# Altium schematic sheet 3723_connectors.SchDoc
size A3; SheetNumber: 2; SheetTotal: 3
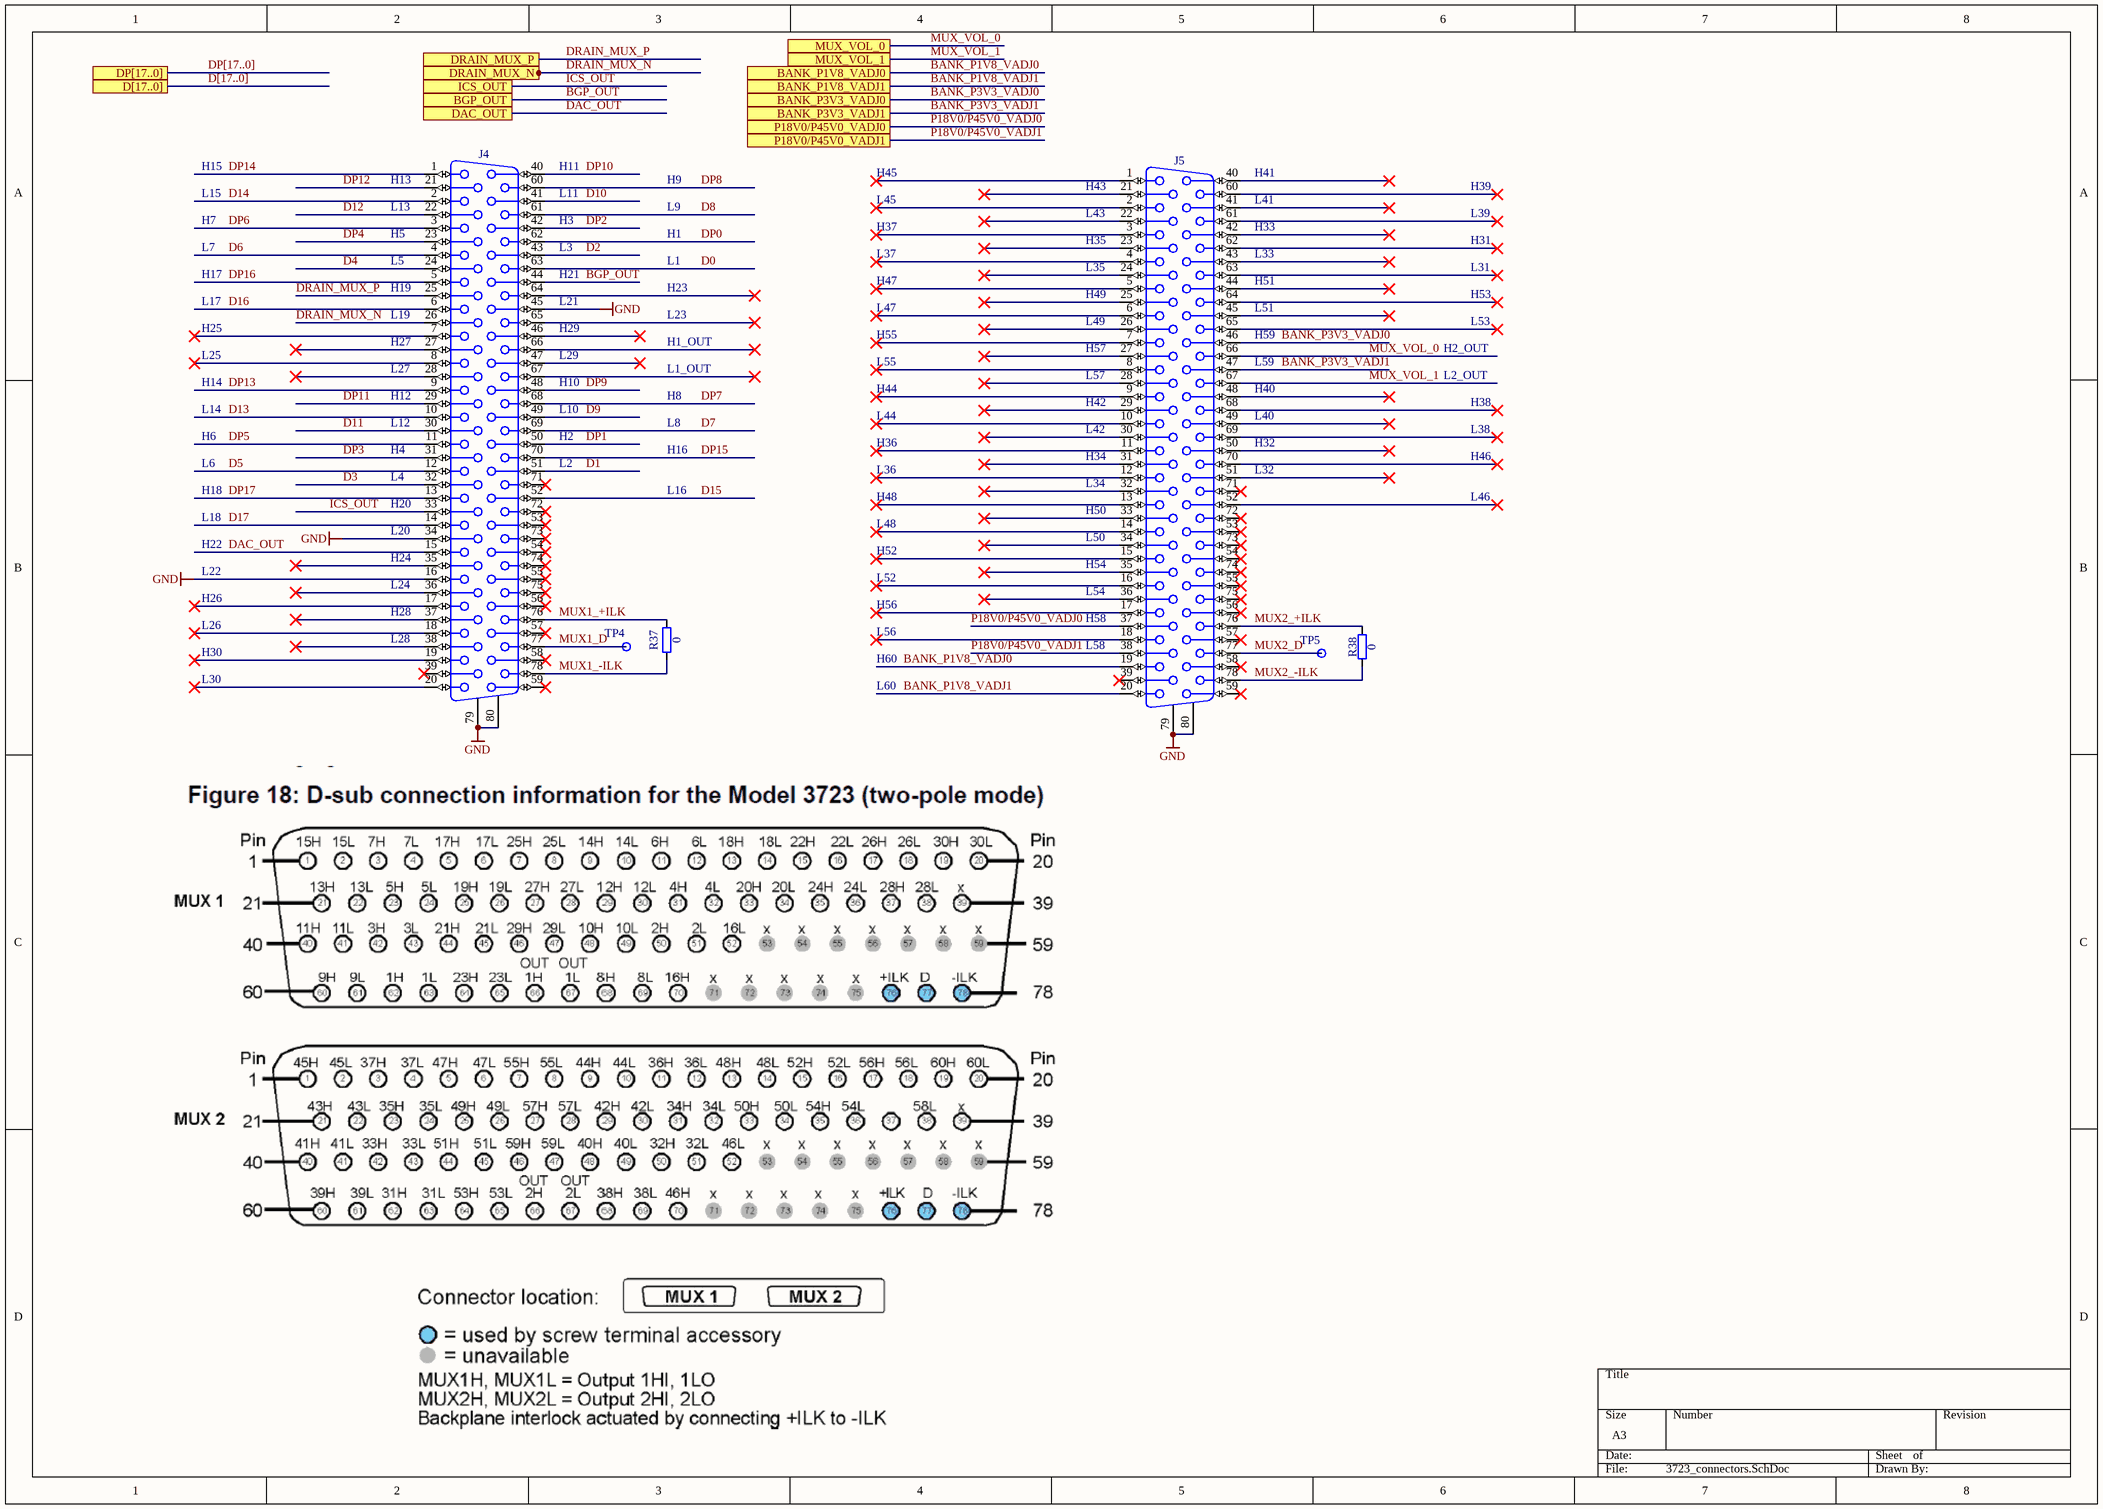
[diagram p0: 3723_connectors.SchDoc]

## Parts
J4  D-Sub 78F  [HARTING_09 56 551 7513]  (value not drawn)
J5  D-Sub 78F  [HARTING_09 56 551 7513]  (value not drawn)
R37  0  [RESC1005X40N]
R38  0  [RESC1005X40N]
TP4  Test Point  [TPS127]  (value not drawn)
TP5  Test Point  [TPS127]  (value not drawn)

## Ports
BANK_P1V8_VADJ0 (see top_PW[5A], 3732_connectors[1C]), BANK_P1V8_VADJ1 (see top_PW[5A], 3732_connectors[1C]), BANK_P3V3_VADJ0 (see top_PW[5A], 3732_connectors[3C]), BANK_P3V3_VADJ1 (see top_PW[5A], 3732_connectors[3C]), BGP_OUT (see top_PW[4A]), D[17..0] (see top_PW[4A]), DAC_OUT (see top_PW[4A]), DP[17..0] (see top_PW[4A]), DRAIN_MUX_N (see top_PW[4A]), DRAIN_MUX_P (see top_PW[4A]), ICS_OUT (see top_PW[4A]), MUX_VOL_0, MUX_VOL_1 (see top_PW[5A]), P18V0/P45V0_VADJ0 (see top_PW[5A]), P18V0/P45V0_VADJ1 (see top_PW[5A])

## Nets
GND: J4.16 J4.34 J4.45 J4.79 J4.80 J5.79 J5.80
BANK_P1V8_VADJ0: J5.19 ; port BANK_P1V8_VADJ0
BANK_P1V8_VADJ1: J5.20 ; port BANK_P1V8_VADJ1
BANK_P3V3_VADJ0: J5.46 ; port BANK_P3V3_VADJ0
BANK_P3V3_VADJ1: J5.47 ; port BANK_P3V3_VADJ1
BGP_OUT: J4.44 ; port BGP_OUT
D0: J4.63
D1: J4.51
D2: J4.43
D3: J4.32
D4: J4.24
D5: J4.12
D6: J4.4
D7: J4.69
D8: J4.61
D9: J4.49
D10: J4.41
D11: J4.30
D12: J4.22
D13: J4.10
D14: J4.2
D15: J4.52
D16: J4.6
D17: J4.14
DAC_OUT: J4.15 ; port DAC_OUT
DP0: J4.62
DP1: J4.50
DP2: J4.42
DP3: J4.31
DP4: J4.23
DP5: J4.11
DP6: J4.3
DP7: J4.68
DP8: J4.60
DP9: J4.48
DP10: J4.40
DP11: J4.29
DP12: J4.21
DP13: J4.9
DP14: J4.1
DP15: J4.70
DP16: J4.5
DP17: J4.13
DRAIN_MUX_N: J4.26 ; port DRAIN_MUX_N
DRAIN_MUX_P: J4.25 ; port DRAIN_MUX_P
ICS_OUT: J4.33 ; port ICS_OUT
MUX1_+ILK: J4.76 R37.2
MUX1_-ILK: J4.78 R37.1
MUX1_D: J4.77 TP4.1
MUX2_+ILK: J5.76 R38.2
MUX2_-ILK: J5.78 R38.1
MUX2_D: J5.77 TP5.1
MUX_VOL_0: J5.66 ; port MUX_VOL_0
MUX_VOL_1: J5.67 ; port MUX_VOL_1
P18V0/P45V0_VADJ0: J5.37 ; port P18V0/P45V0_VADJ0
P18V0/P45V0_VADJ1: J5.38 ; port P18V0/P45V0_VADJ1

Not connected (* = marked no-connect by the designer): J4 7* 8* 17* 18* 19* 20* 27* 28* 35* 36* 37* 38* 39* 46* 47* 53* 54* 55* 56* 57* 58* 59* 64* 65* 66* 67* 71* 72* 73* 74* 75*; J5 1* 2* 3* 4* 5* 6* 7* 8* 9* 10* 11* 12* 13* 14* 15* 16* 17* 18* 21* 22* 23* 24* 25* 26* 27* 28* 29* 30* 31* 32* 33* 34* 35* 36* 39* 40* 41* 42* 43* 44* 45* 48* 49* 50* 51* 52* 53* 54* 55* 56* 57* 58* 59* 60* 61* 62* 63* 64* 65* 68* 69* 70* 71* 72* 73* 74* 75*

## Buses and harness runs
bus D[17..0] = port D[17..0]
bus DP[17..0] = port DP[17..0]

## Notes on the sheet
- H15
- (near J4) H13
- (near J4) H11
- H9
- H45
- (near J5) H41
- L15
- H7
- (near J4) L13
- (near J4) H5
- (near J4) L11
- (near J4) H3
- L9
- H1
- H37
- L45
- (near J5) H35
- (near J5) H43
- (near J5) L43
- (near J5) H33
- (near J5) L41
- H31
- H39
- L39
- L17
- L7
- H17
- (near J4) L19
- (near J4) L5
- (near J4) H19
- (near J4) L21
- (near J4) L3
- (near J4) H21
- L23
- L1
- H23
- H47
- L37
- L47
- (near J5) H49
- (near J5) L35
- (near J5) H51
- (near J5) L33
- (near J5) L51
- H53
- L31
- L25
- H25
- (near J4) L27
- (near J4) H27
- (near J4) L29
- (near J4) H29
- H1_OUT
- L1_OUT
- H55
- L55
- (near J5) H57
- (near J5) L49
- (near J5) L57
- (near J5) H59
- (near J5) L59
- H2_OUT
- L2_OUT
- L53
- L14
- H6
- H14
- (near J4) L12
- (near J4) H4
- (near J4) H12
- (near J4) L10
- (near J4) H2
- (near J4) H10
- L8
- H8
- H16
- H36
- H44
- L44
- (near J5) H42
- (near J5) L42
- (near J5) H32
- (near J5) H40
- (near J5) L40
- H38
- L38
- L6
- H18
- (near J4) L4
- (near J4) H20
- (near J4) L2
- L16
- H48
- L36
- (near J5) H34
- (near J5) H50
- (near J5) L34
- (near J5) L32
- H46
- L46
- L18
- L22
- H22
- (near J4) L20
- (near J4) L24
- (near J4) H24
- H52
- L48
- L52
- (near J5) H54
- (near J5) L50
- L26
- H26
- (near J4) L28
- (near J4) H28
- H56
- L56
- (near J5) H58
- (near J5) L54
- (near J5) L58
- L30
- H30
- H60
- L60

## Library data of the parts
J4 J5 = HARTING_09 56 551 7513: Connector D-sub 78 Female; Part Description: High Density Straight Female D-SUB 78 Contacts, with Grounding Board Locks and Female Screw Lock 4-40; PressFit: No; Part Number: HARTING_09 56 551 7513; Component Kind: Standard; Component Type: Standard; Pin Count: 80; Family: D-Sub 78F; Mounted: Yes; Socket: No; SMD: No; Sense: No; Status: None; Manufacturer: HARTING; Manufacturer Part Number: 09 56 551 7513; ComponentHeight: 12.7mm; HelpURL: \\cern.ch\dfs\Applications\Altium\Datasheets\HARTING_09 56 551 7513.pdf; Author: CERN DEM JLC; CreateDate: 15.12.2014; LatestRevisionDate: 15.12.2014
R37 R38 = R0402_0R_JUMPER: Resistor; Part Description: 1A (0.05R Max DC Resistance) Zero Ohm Jumper; Manufacturer: GENERIC; Manufacturer1 Part Number: 232270591001L; PressFit: No; Part Number: R0402_0R_JUMPER; Component Kind: Standard; Component Type: Standard; Pin Count: 2; Value: 0; Status: Not Recommended; Manufacturer Part Number: R0402_0R_JUMPER; Case: 0402; Mounted: Yes; Sense: No; Socket: No; SMD: Yes; Manufacturer1 Example: YAGEO PHYCOMP; Manufacturer1 ComponentHeight: 0.4mm; HelpURL: \\cern.ch\dfs\Applications\Altium\Datasheets\R0402_Phycomp_RC0402.pdf; Author: CERN DEM JLC; CreateDate: 03.12.2007; LatestRevisionDate: 17.10.2012
TP4 TP5 = SMD_PAD_1.27X1.27MM: Part Description: 1.27mm x 1.27mm PCB Copper Area (SMD Test Point); Mounted: No; Part Number: SMD_PAD_1.27X1.27MM; Component Kind: Standard (No BOM); Component Type: Standard (No BOM); Pin Count: 1; Family: Test Point; Socket: No; SMD: No; Sense: No; Status: None; ComponentHeight: 0mm; HelpURL: Undefined; Author: CERN DEM JLC; CreateDate: 12.01.2008; LatestRevisionDate: 12.01.2008; PackageDescription: 1.27mm x 1.27mm PCB Copper Area (SMD Test Point)